# EAGLE design BRAIN_3 (EAGLE 7.5.0)
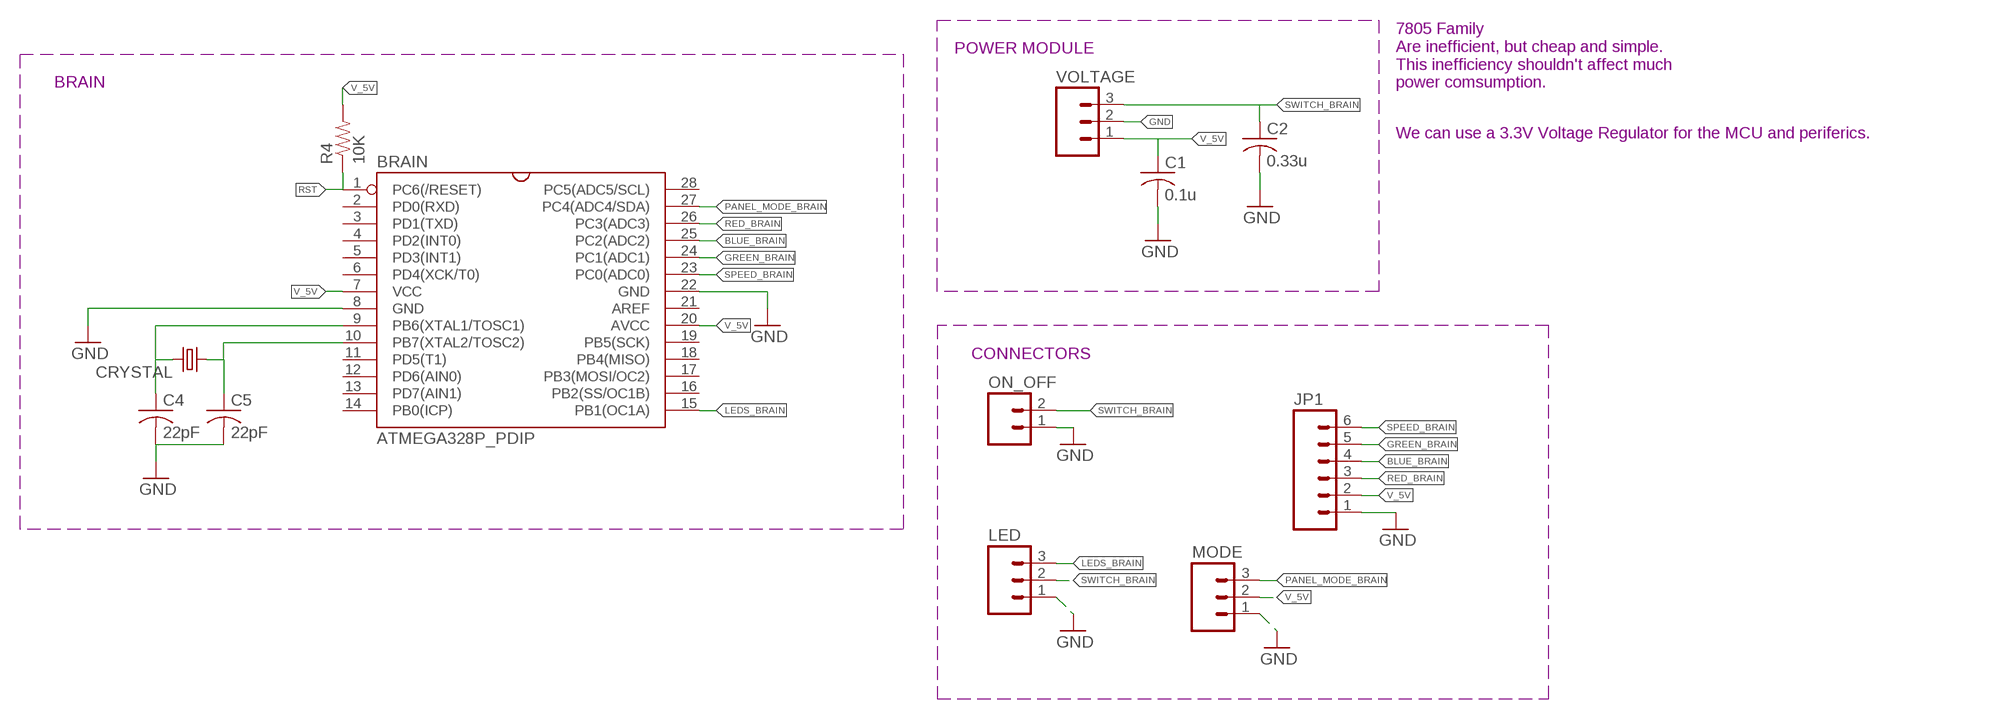
[diagram p0: schematic, sheet 1]

## Parts
BRAIN  ATMEGA328P_PDIP  [DIL-28-3]
C1  0.1u  C-US025-025X050  [C025-025X050]
C2  0.33u  C-US025-025X050  [C025-025X050]
C4  22pF  C-US025-024X044  [C025-024X044]
C5  22pF  C-US025-024X044  [C025-024X044]
CRYSTAL  CRYSTALHC49US  [HC49US]
JP1  M06NO_SILK_FEMALE_PTH  [1X06_NO_SILK]
LED  M03PTH  [1X03]
MODE  M03PTH  [1X03]
ON_OFF  M02PTH  [1X02]
R4  10K  RESISTORAXIAL-0.3  [AXIAL-0.3]
VOLTAGE  M03PTH  [1X03]

## Nets
BLUE_BRAIN: BRAIN.25(PC2(ADC2)) JP1.4
GND: BRAIN.8(GND) BRAIN.22(GND) C1.2 C2.2 C4.2 C5.2 JP1.1 LED.1 MODE.1 ON_OFF.1 VOLTAGE.2
GREEN_BRAIN: BRAIN.24(PC1(ADC1)) JP1.5
LEDS_BRAIN: BRAIN.15(PB1(OC1A)) LED.3
N$7: BRAIN.9(PB6(XTAL1/TOSC1)) C4.1 CRYSTAL.2
N$8: BRAIN.10(PB7(XTAL2/TOSC2)) C5.1 CRYSTAL.1
PANEL_MODE_BRAIN: BRAIN.27(PC4(ADC4/SDA)) MODE.3
RED_BRAIN: BRAIN.26(PC3(ADC3)) JP1.3
RST: BRAIN.1(PC6(/RESET)) R4.P$1
SPEED_BRAIN: BRAIN.23(PC0(ADC0)) JP1.6
SWITCH_BRAIN: C2.1 LED.2 ON_OFF.2 VOLTAGE.3
V_5V: BRAIN.7(VCC) BRAIN.20(AVCC) C1.1 JP1.2 MODE.2 R4.P$2 VOLTAGE.1
Unconnected: BRAIN.2(PD0(RXD)) BRAIN.3(PD1(TXD)) BRAIN.4(PD2(INT0)) BRAIN.5(PD3(INT1)) BRAIN.6(PD4(XCK/T0)) BRAIN.11(PD5(T1)) BRAIN.12(PD6(AIN0)) BRAIN.13(PD7(AIN1)) BRAIN.14(PB0(ICP)) BRAIN.16(PB2(SS/OC1B)) BRAIN.17(PB3(MOSI/OC2)) BRAIN.18(PB4(MISO)) BRAIN.19(PB5(SCK)) BRAIN.21(AREF) BRAIN.28(PC5(ADC5/SCL))

## Notes on the sheet
- POWER MODULE
- BRAIN
- 7805 Family
  Are inefficient, but cheap and simple.
  This inefficiency shouldn't affect much
  power comsumption.
- We can use a 3.3V Voltage Regulator for the MCU and periferics.
- CONNECTORS

## Library data of the parts
BRAIN = RodrigoMarques_Parts:ATMEGA328P_PDIP: uC used in the Arduino 32kb flash, 1k EEPROM, 2k SRAM This is the through-hole version of this chip.
C1 C2 C4 C5 = adafruit:C-US: CAPACITOR, American symbol
CRYSTAL = SparkFun-FreqCtrl:CRYSTAL: Various standard crystals. Proven footprints.
JP1 = SparkFun-Connectors:M06: Header 6 Standard 6-pin 0.1" header. Use with straight break away headers (SKU : PRT-00116), right angle break away headers (PRT-00553), swiss pins (PRT-00743), machine pins (PRT-00117), and female headers (PRT-00115). Molex polarized connector foot print use with SKU : PRT-08094 with associated crimp pins and housings. NOTES ON THE VARIANTS LOCK and LOCK_LONGPADS... This footprint was designed to help hold the alignment of a through-hole component (i.e. 6-pin header) while soldering it into place. You may notice that each hole has been shifted either up or down by 0.005 of an inch from it's more standard position (which is a perfectly straight line). This slight alteration caused the pins (the squares in the middle) to touch the edges of the holes. Because they are alternating, it causes a "brace" to hold the component in place. 0.005 has proven to be the perfect amount of "off-center" position when using our standard breakaway headers. Although looks a little odd when you look at the bare footprint, once you have a header in there, the alteration is very hard to notice. Also,if you push a header all the way into place, it is covered up entirely on the bottom side. This idea of altering the position of holes to aid alignment will be further integrated into the Sparkfun Library for other footprints. It can help hold any component with 3 or more connection pins.; PROD_ID: CONN-08437
LED MODE VOLTAGE = SparkFun-Connectors:M03: Header 3 Standard 3-pin 0.1" header. Use with straight break away headers (SKU : PRT-00116), right angle break away headers (PRT-00553), swiss pins (PRT-00743), machine pins (PRT-00117), and female headers (PRT-00115). Molex polarized connector foot print use with SKU : PRT-08232 with associated crimp pins and housings.
ON_OFF = SparkFun-Connectors:M02: Standard 2-pin 0.1" header. Use with - straight break away headers ( PRT-00116) - right angle break away headers (PRT-00553) - swiss pins (PRT-00743) - machine pins (PRT-00117) - female headers (PRT-00115) Molex polarized connector foot print use with: PRT-08233 with associated crimp pins and housings. 2.54_SCREWTERM for use with PRT-10571. 3.5mm Screw Terminal footprints for PRT-08084 5mm Screw Terminal footprints for use with PRT-08432
R4 = SparkFun-Passives:RESISTOR: Resistor Basic schematic elements and footprints for 0603, 1206, and PTH resistors.

## Net classes
0 default: width 0.254 mm

## Board
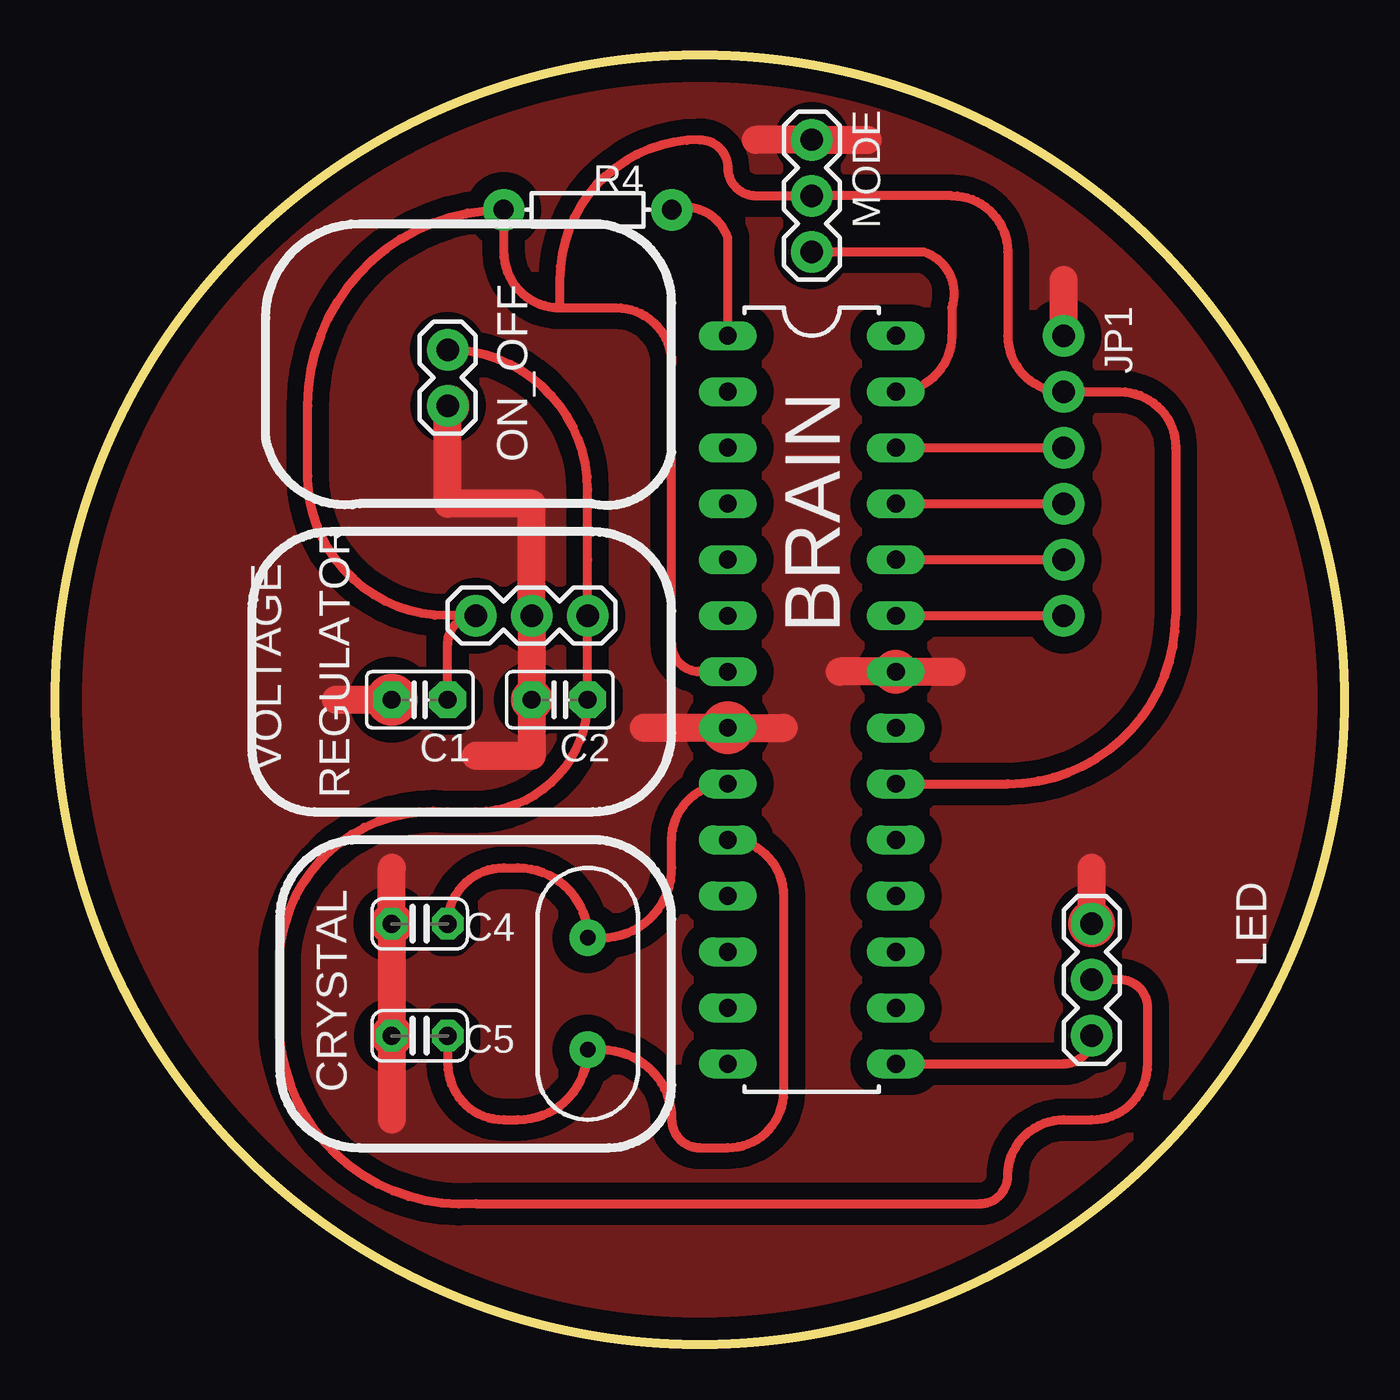
[diagram p1: board, top side]

Size 58.48 x 58.48 mm. Coordinates in mm from the lower left corner, seen from the top.
Outline: circle at 29.24,29.24 radius 29.24
Copper layers (1*16): Top 0.035mm / dielectric 1.5mm / Bottom 0.035mm
Design rules "default *": minimum track width 10mil, minimum drill 24mil, track to track 30mil, track to pad 30mil, pad to pad 20mil, via to via 20mil, smd to smd 20mil, copper to edge 40mil, drill to drill 8mil, minimum pad ring 10mil, minimum via ring 8mil, stop-mask expansion 4mil, vias tented up to drill 0mil, thermal gap 10mil

### Footprints (pad centres in the part's own frame; a part is rotated, then mirrored left to right if it is on the bottom)
DIL-28-3 = drill 0.813 long: 1 -16.51,-3.81; 2 -13.97,-3.81; 3 -11.43,-3.81; 4 -8.89,-3.81; 5 -6.35,-3.81; 6 -3.81,-3.81; 7 -1.27,-3.81; 8 1.27,-3.81; 9 3.81,-3.81; 10 6.35,-3.81; 11 8.89,-3.81; 12 11.43,-3.81; 13 13.97,-3.81; 14 16.51,-3.81; 15 16.51,3.81; 16 13.97,3.81; 17 11.43,3.81; 18 8.89,3.81; 19 6.35,3.81; 20 3.81,3.81; 21 1.27,3.81; 22 -1.27,3.81; 23 -3.81,3.81; 24 -6.35,3.81; 25 -8.89,3.81; 26 -11.43,3.81; 27 -13.97,3.81; 28 -16.51,3.81
C025-025X050 = drill 0.813 pad 1.676 octagon: 1 -1.27,0; 2 1.27,0
C025-024X044 = drill 0.813 pad 1.422 octagon: 1 -1.27,0; 2 1.27,0
HC49US = drill 0.7 pad 1.651: 1 -2.54,0; 2 2.54,0
1X06_NO_SILK = drill 1.016 pad 1.88: 1 0,0; 2 2.54,0; 3 5.08,0; 4 7.62,0; 5 10.16,0; 6 12.7,0
1X03 = drill 1.016 pad 1.88: 1 0,0; 2 2.54,0; 3 5.08,0
1X02 = drill 1.016 pad 1.88: 1 0,0; 2 2.54,0
AXIAL-0.3 = drill 0.9 pad 1.88: P$1 -3.81,0; P$2 3.81,0

### Placement (x,y rotation side)
BRAIN  34.32,29.24 270 top
C1  16.54,29.24 180 top
C2  22.89,29.24 180 top
C4  16.54,19.08 180 top
C5  16.54,14 180 top
CRYSTAL  24.16,15.9 90 top
JP1  45.75,45.75 270 top
LED  47.02,19.08 270 top
MODE  34.32,54.64 270 top
ON_OFF  17.81,42.57 90 top
R4  24.16,51.46 180 top
VOLTAGE  19.08,33.05 0 top

### Tracks (layer width: path | path; a pad name or v marks a point on that pad's centre or on a via)
BLUE_BRAIN
  Top 0.406: BRAIN.25 JP1.4
GND
  Top 1.27: LED.1 47.02,21.62 | 33.05,27.97 BRAIN.8 26.7,27.97 | JP1.1 45.75,48.29 | C1.2 12.73,29.24 | 19.08,26.7 21.62,26.7 C2.2 VOLTAGE.2 21.62,38.13 17.81,38.13 ON_OFF.1 | 35.59,30.51 BRAIN.22 40.67,30.51 | C5.2 C4.2 15.27,21.62 | C5.2 15.27,12.73 | C5.2 15.27,10.19 | 36.86,54.64 MODE.1 31.78,54.64
  pour Top: -7.59,67.34 -7.59,-6.32 66.07,-6.32 66.07,68.61 -7.59,68.61
GREEN_BRAIN
  Top 0.406: BRAIN.24 JP1.5
LEDS_BRAIN
  Top 0.406: BRAIN.15 45.75,12.73 arc90 LED.3
N$7
  Top 0.406: BRAIN.9 arc90 27.97,22.89 27.97,21.62 arc-90 24.79,18.44 CRYSTAL.2 arc90 20.98,21.62 20.35,21.62 arc90 C4.1
N$8
  Top 0.406: BRAIN.10 arc-90 33.05,20.35 33.05,11.46 arc-90 30.51,8.92 29.24,8.92 arc-90 27.97,10.19 arc90 24.79,13.36 CRYSTAL.1 arc-90 20.98,10.19 20.35,10.19 arc-90 17.81,12.73 C5.1
PANEL_MODE_BRAIN
  Top 0.406: MODE.3 39.4,49.56 arc-90 40.67,47.02 40.67,45.75 arc-90 BRAIN.27
RED_BRAIN
  Top 0.406: BRAIN.26 JP1.3
RST
  Top 0.406: BRAIN.1 30.51,50.19 arc90 R4.P$1
SPEED_BRAIN
  Top 0.406: BRAIN.23 JP1.6
SWITCH_BRAIN
  Top 0.406: LED.2 48.29,16.54 arc-90 49.56,15.27 49.56,12.73 arc-90 47.02,10.19 45.75,10.19 arc90 43.21,7.65 arc-90 41.94,6.38 19.08,6.38 arc-90 10.19,14 10.19,17.81 arc-90 17.81,24.16 19.08,24.16 arc90 C2.1 VOLTAGE.3 | VOLTAGE.3 24.16,35.59 | VOLTAGE.3 24.16,38.76 arc90 ON_OFF.2
V_5V
  Top 0.406: 38.76,25.43 BRAIN.20 43.21,25.43 arc90 50.83,33.05 50.83,40.67 arc90 48.29,43.21 JP1.2 arc-90 43.21,45.75 43.21,49.56 arc90 40.67,52.1 MODE.2 31.78,52.1 arc-90 30.51,53.37 arc90 29.24,54.64 arc90 22.89,48.29 22.89,47.02 | BRAIN.7 29.24,30.51 arc-90 27.97,31.78 27.97,44.48 arc90 25.43,47.02 22.89,47.02 | 22.89,47.02 arc-90 20.35,49.56 R4.P$2 arc90 11.46,42.57 11.46,39.4 arc90 17.81,33.05 VOLTAGE.1 arc90 17.81,31.78 C1.1
(copper drawn outside any net)
  shapes: Top circle x11

### Text on the board
tPlace: REGULATOR